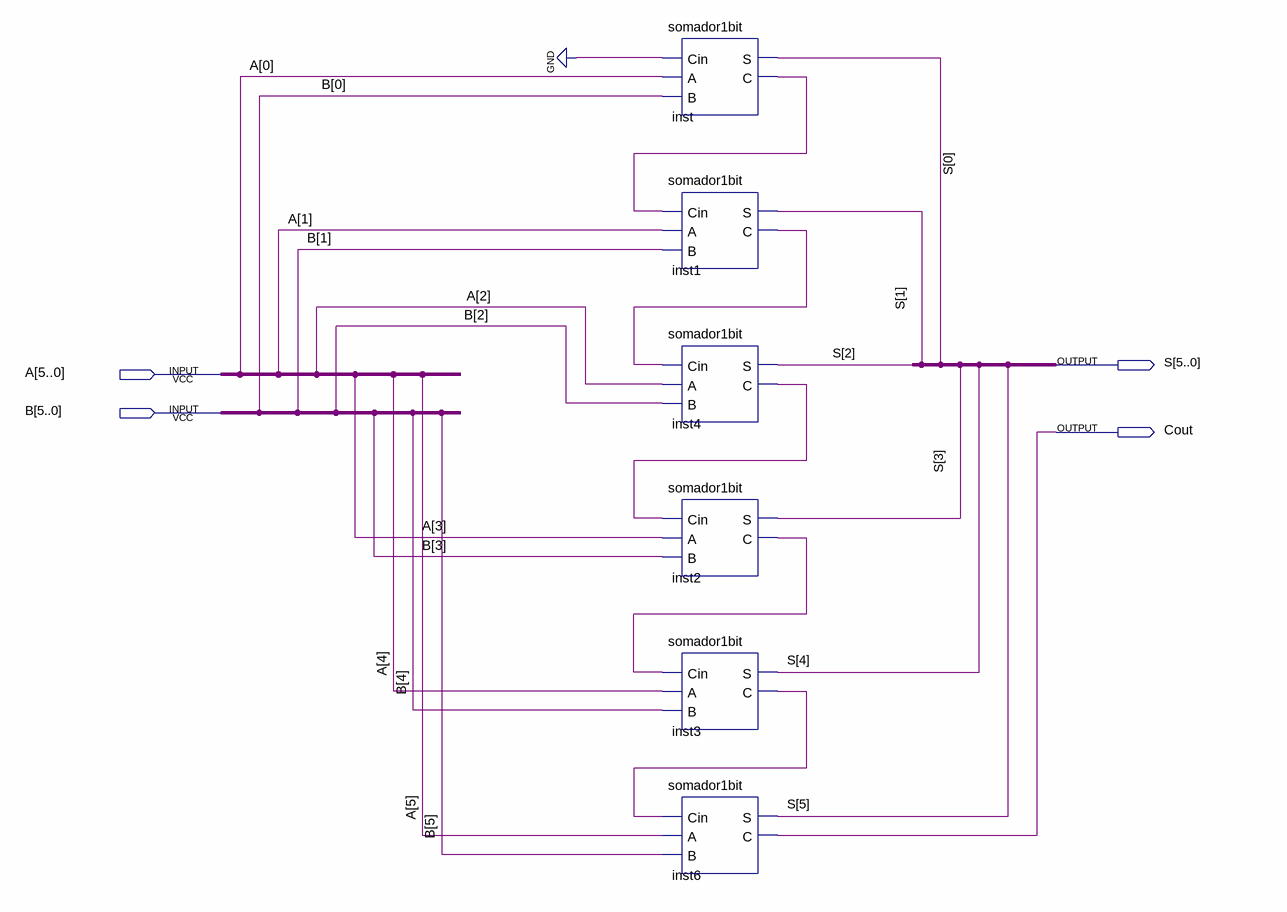
[diagram p0: schematic sheet]
// Quartus schematic somador5bits.bdf as structural Verilog: 6 symbols, 4 pins
module somador5bits (
  input  [5:0] A,
  input  [5:0] B,
  output [5:0] S,
  output Cout
);

  wire inst1_c, inst2_c, inst3_c, inst4_c, inst_c;

  somador1bit inst (.Cin(1'b0), .A(A[0]), .B(B[0]), .S(S[0]), .C(inst_c));
  somador1bit inst1 (.Cin(inst_c), .A(A[1]), .B(B[1]), .S(S[1]), .C(inst1_c));
  somador1bit inst4 (.Cin(inst1_c), .A(A[2]), .B(B[2]), .S(S[2]), .C(inst4_c));
  somador1bit inst2 (.Cin(inst4_c), .A(A[3]), .B(B[3]), .S(S[3]), .C(inst2_c));
  somador1bit inst3 (.Cin(inst2_c), .A(A[4]), .B(B[4]), .S(S[4]), .C(inst3_c));
  somador1bit inst6 (.Cin(inst3_c), .A(A[5]), .B(B[5]), .S(S[5]), .C(Cout));
endmodule
